# Altium project 7Bot.PrjPcb
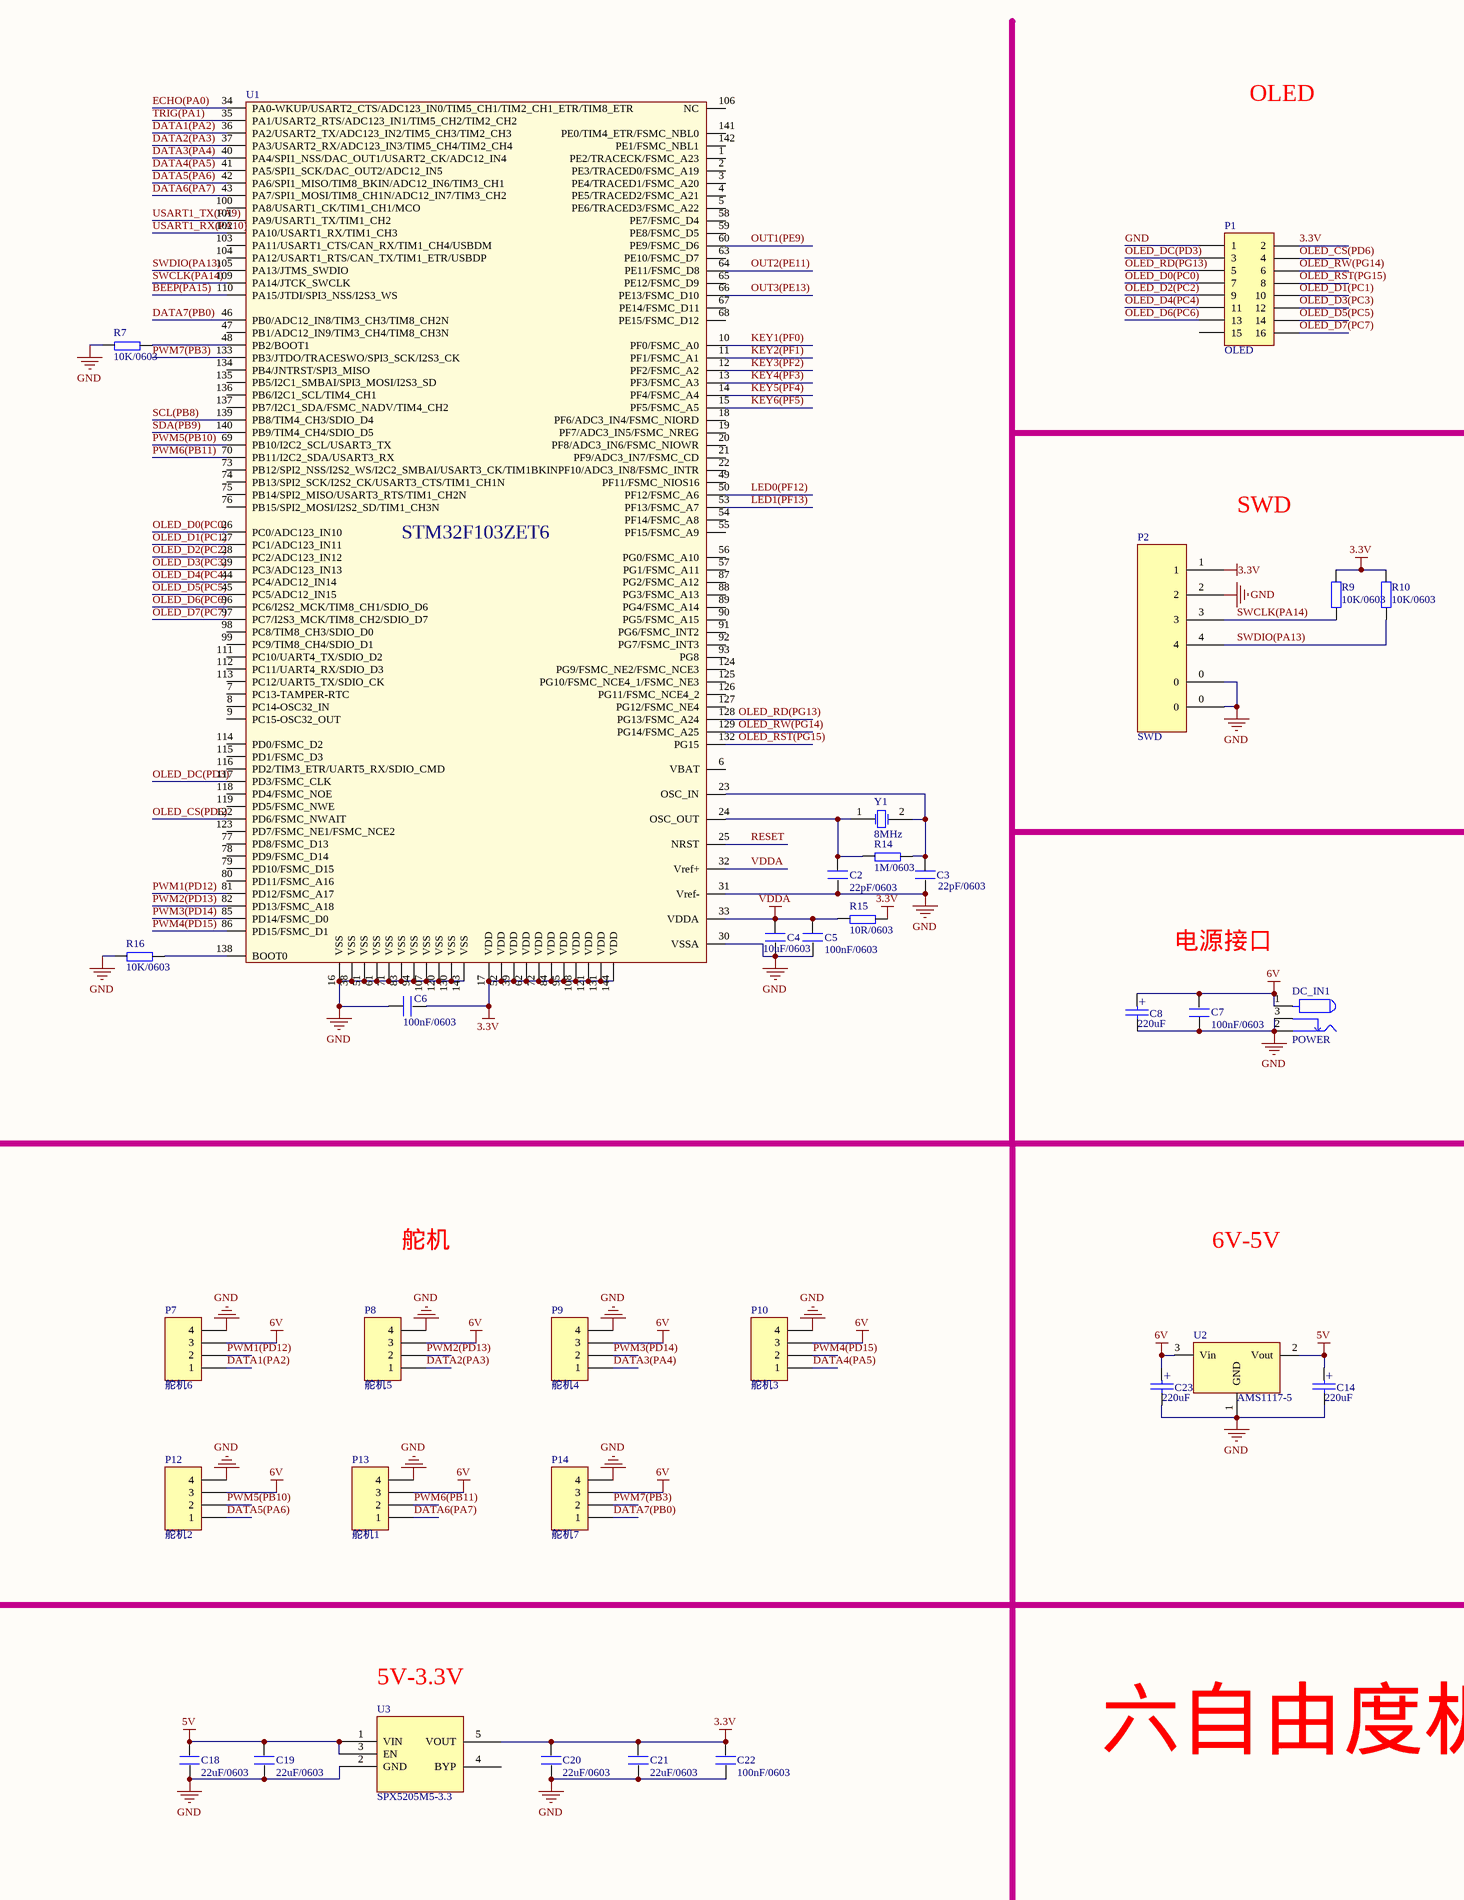
[diagram p0: 7BotSCH.SchDoc, left]
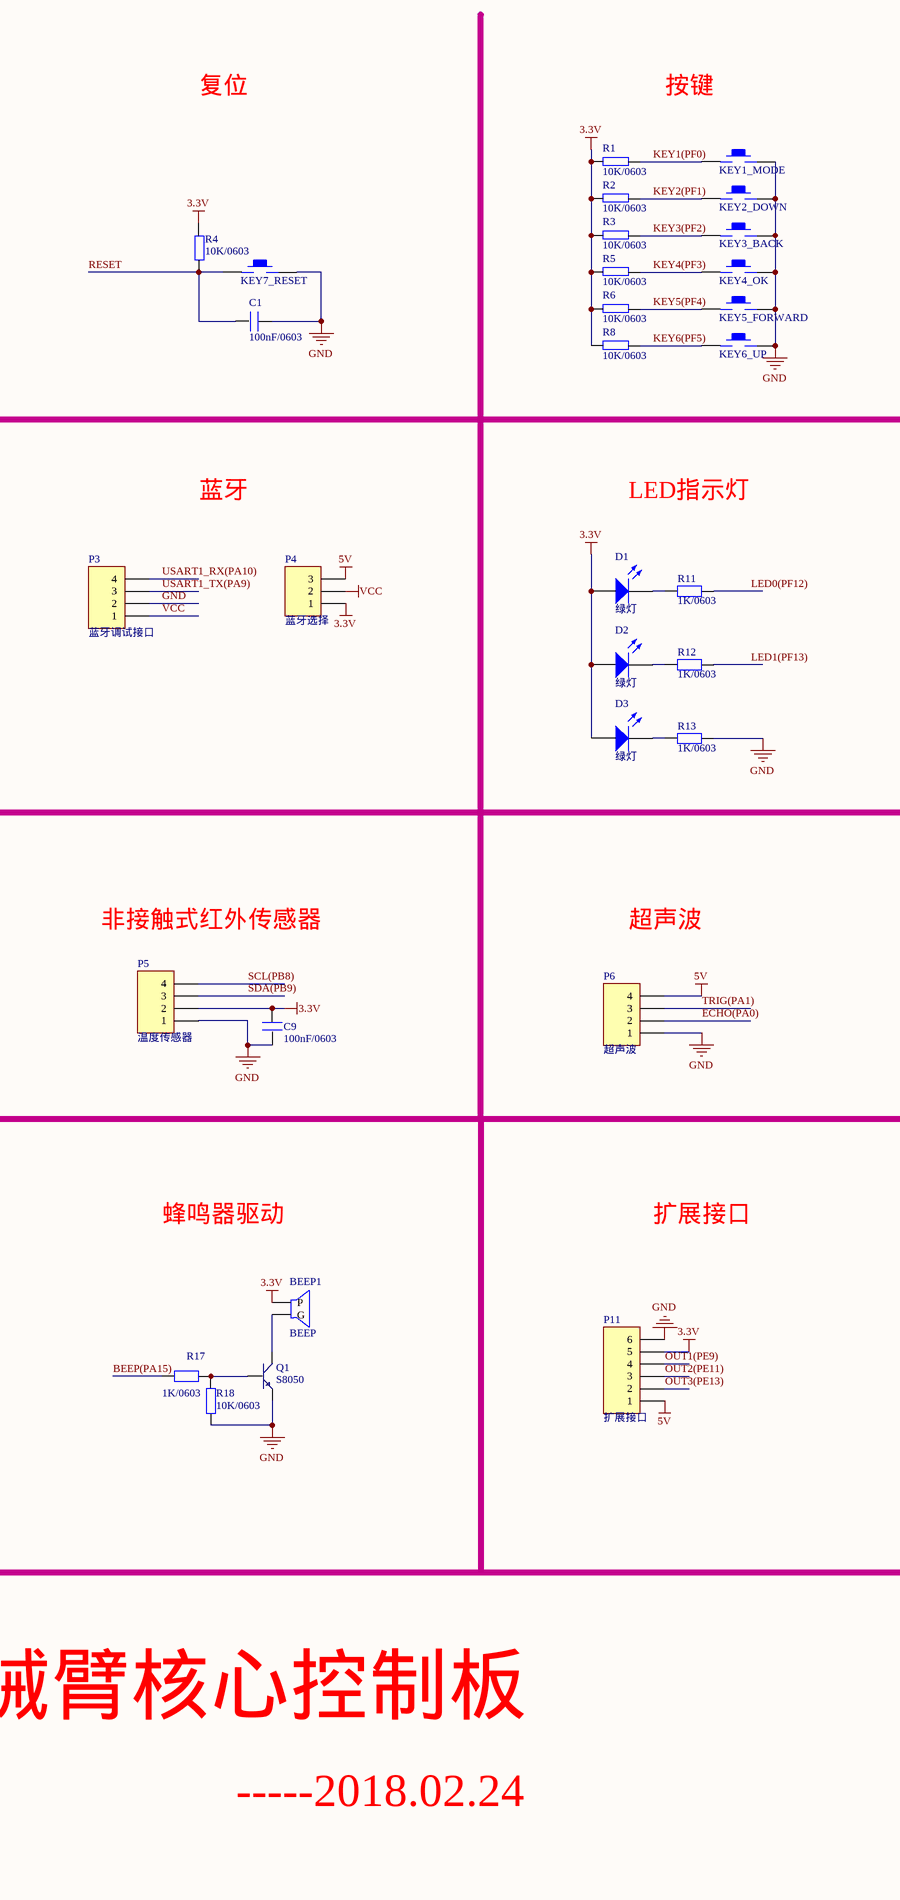
[diagram p1: 7BotSCH.SchDoc, right]
1 sheet, 65 parts. Net scope: global (net labels, ports and power ports of the same name join across sheets).
Board file: 7BotPCB.PcbDoc

## Sheet 7BotSCH.SchDoc
size A2

### Parts
BEEP1  BEEP  [BELL-5]
C1  100nF/0603  [0603-1]
C2  22pF/0603  [0603-1]
C3  22pF/0603  [0603-1]
C4  10uF/0603  [0603-1]
C5  100nF/0603  [0603-1]
C6  100nF/0603  [0603-1]
C7  100nF/0603  [0603-1]
C8  220uF  [1210]
C9  100nF/0603  [0603-1]
C14  220uF  [1210]
C18  22uF/0603  [0603-1]
C19  22uF/0603  [0603-1]
C20  22uF/0603  [0603-1]
C21  22uF/0603  [0603-1]
C22  100nF/0603  [0603-1]
C23  220uF  [1210]
D1  绿灯  [0603-1]
D2  绿灯  [0603-1]
D3  绿灯  [0603-1]
DC_IN1  POWER  [DC10B]
KEY1_MODE  KEY_M  [KEY_M]  (value not drawn)
KEY2_DOWN  KEY_M  [KEY_M]  (value not drawn)
KEY3_BACK  KEY_M  [KEY_M]  (value not drawn)
KEY4_OK  KEY_M  [KEY_M]  (value not drawn)
KEY5_FORWARD  KEY_M  [KEY_M]  (value not drawn)
KEY6_UP  KEY_M  [KEY_M]  (value not drawn)
KEY7_RESET  KEY_M  [KEY_M]  (value not drawn)
P1  OLED  [HDR2X8]
P2  SWD  [MOLEX4脚]
P3  蓝牙调试接口  [HDR1X4]
P4  蓝牙选择  [HDR1X3]
P5  温度传感器  [HDR1X4]
P6  超声波  [HDR1X4]
P7  舵机6  [HDR1X4]
P8  舵机5  [HDR1X4]
P9  舵机4  [HDR1X4]
P10  舵机3  [HDR1X4]
P11  扩展接口  [HDR1X6]
P12  舵机2  [HDR1X4]
P13  舵机1  [HDR1X4]
P14  舵机7  [HDR1X4]
Q1  S8050  [SOT-23R]
R1  10K/0603  [0603-1]
R2  10K/0603  [0603-1]
R3  10K/0603  [0603-1]
R4  10K/0603  [0603-1]
R5  10K/0603  [0603-1]
R6  10K/0603  [0603-1]
R7  10K/0603  [0603-1]
R8  10K/0603  [0603-1]
R9  10K/0603  [0603-1]
R10  10K/0603  [0603-1]
R11  1K/0603  [0603-1]
R12  1K/0603  [0603-1]
R13  1K/0603  [0603-1]
R14  1M/0603  [0603-1]
R15  10R/0603  [0603-1]
R16  10K/0603  [0603-1]
R17  value 1K/0603  [0603-1]  (hidden comment: Res1)
R18  value 10K/0603  [0603-1]  (hidden comment: Res1)
U1  STM32F103ZET6  [LQFP144]
U2  AMS1117-5  [SOT-223L]
U3  SPX5205M5-3.3  [SOT23-5]
Y1  8MHz  [25M两脚无源晶振5032]

### Nets
3.3V: BEEP1.1(P) C6.2 C9.2 C20.2 C21.2 C22.2 D1.1(A) D2.1(A) D3.1(A) P1.2 P2.1 P4.1 P5.2 P11.5 R1.2 R2.2 R3.2 R4.2 R5.2 R6.2 R8.2 R9.1 R10.1 R15.2 U1.17(VDD) U1.39(VDD) U1.52(VDD) U1.62(VDD) U1.72(VDD) U1.84(VDD) U1.95(VDD) U1.108(VDD) U1.121(VDD) U1.131(VDD) U1.144(VDD) U3.5(VOUT)
5V: C14.1 C18.2 C19.2 P4.3 P6.4 P11.1 U2.2(Vout) U3.1(VIN) U3.3(EN)
6V: C7.1 C8.1 C23.1 DC_IN1.1 P7.3 P8.3 P9.3 P10.3 P12.3 P13.3 P14.3 U2.3(Vin)
GND: C1.1 C2.1 C3.1 C4.1 C5.1 C6.1 C7.2 C8.2 C9.1 C14.2 C18.1 C19.1 C20.1 C21.1 C22.1 C23.2 DC_IN1.2 DC_IN1.3 KEY1_MODE.2 KEY2_DOWN.2 KEY3_BACK.2 KEY4_OK.2 KEY5_FORWARD.2 KEY6_UP.2 KEY7_RESET.2 P1.1 P2.0 P2.2 P3.2 P5.1 P6.1 P7.4 P8.4 P9.4 P10.4 P11.6 P12.4 P13.4 P14.4 Q1.1(E) R7.1 R13.1 R16.1 R18.1 U1.16(VSS) U1.30(VSSA) U1.31(Vref-) U1.38(VSS) U1.51(VSS) U1.61(VSS) U1.71(VSS) U1.83(VSS) U1.94(VSS) U1.107(VSS) U1.120(VSS) U1.130(VSS) U1.143(VSS) U2.1(GND) U3.2(GND)
VCC: P3.1 P4.2
VDDA: C4.2 C5.2 R15.1 U1.32(Vref+) U1.33(VDDA)
BEEP(PA15): R17.1 U1.110(PA15/JTDI/SPI3_NSS/I2S3_WS)
DATA1(PA2): P7.1 U1.36(PA2/USART2_TX/ADC123_IN2/TIM5_CH3/TIM2_CH3)
DATA2(PA3): P8.1 U1.37(PA3/USART2_RX/ADC123_IN3/TIM5_CH4/TIM2_CH4)
DATA3(PA4): P9.1 U1.40(PA4/SPI1_NSS/DAC_OUT1/USART2_CK/ADC12_IN4)
DATA4(PA5): P10.1 U1.41(PA5/SPI1_SCK/DAC_OUT2/ADC12_IN5)
DATA5(PA6): P12.1 U1.42(PA6/SPI1_MISO/TIM8_BKIN/ADC12_IN6/TIM3_CH1)
DATA6(PA7): P13.1 U1.43(PA7/SPI1_MOSI/TIM8_CH1N/ADC12_IN7/TIM3_CH2)
DATA7(PB0): P14.1 U1.46(PB0/ADC12_IN8/TIM3_CH3/TIM8_CH2N)
ECHO(PA0): P6.2 U1.34(PA0-WKUP/USART2_CTS/ADC123_IN0/TIM5_CH1/TIM2_CH1_ETR/TIM8_ETR)
KEY1(PF0): KEY1_MODE.1 R1.1 U1.10(PF0/FSMC_A0)
KEY2(PF1): KEY2_DOWN.1 R2.1 U1.11(PF1/FSMC_A1)
KEY3(PF2): KEY3_BACK.1 R3.1 U1.12(PF2/FSMC_A2)
KEY4(PF3): KEY4_OK.1 R5.1 U1.13(PF3/FSMC_A3)
KEY5(PF4): KEY5_FORWARD.1 R6.1 U1.14(PF4/FSMC_A4)
KEY6(PF5): KEY6_UP.1 R8.1 U1.15(PF5/FSMC_A5)
LED0(PF12): R11.1 U1.50(PF12/FSMC_A6)
LED1(PF13): R12.1 U1.53(PF13/FSMC_A7)
OLED_CS(PD6): P1.4 U1.122(PD6/FSMC_NWAIT)
OLED_D0(PC0): P1.7 U1.26(PC0/ADC123_IN10)
OLED_D1(PC1): P1.10 U1.27(PC1/ADC123_IN11)
OLED_D2(PC2): P1.9 U1.28(PC2/ADC123_IN12)
OLED_D3(PC3): P1.12 U1.29(PC3/ADC123_IN13)
OLED_D4(PC4): P1.11 U1.44(PC4/ADC12_IN14)
OLED_D5(PC5): P1.14 U1.45(PC5/ADC12_IN15)
OLED_D6(PC6): P1.13 U1.96(PC6/I2S2_MCK/TIM8_CH1/SDIO_D6)
OLED_D7(PC7): P1.16 U1.97(PC7/I2S3_MCK/TIM8_CH2/SDIO_D7)
OLED_DC(PD3): P1.3 U1.117(PD3/FSMC_CLK)
OLED_RD(PG13): P1.5 U1.128(PG13/FSMC_A24)
OLED_RST(PG15): P1.8 U1.132(PG15)
OLED_RW(PG14): P1.6 U1.129(PG14/FSMC_A25)
OUT1(PE9): P11.4 U1.60(PE9/FSMC_D6)
OUT2(PE11): P11.3 U1.64(PE11/FSMC_D8)
OUT3(PE13): P11.2 U1.66(PE13/FSMC_D10)
PWM1(PD12): P7.2 U1.81(PD12/FSMC_A17)
PWM2(PD13): P8.2 U1.82(PD13/FSMC_A18)
PWM3(PD14): P9.2 U1.85(PD14/FSMC_D0)
PWM4(PD15): P10.2 U1.86(PD15/FSMC_D1)
PWM5(PB10): P12.2 U1.69(PB10/I2C2_SCL/USART3_TX)
PWM6(PB11): P13.2 U1.70(PB11/I2C2_SDA/USART3_RX)
PWM7(PB3): P14.2 U1.133(PB3/JTDO/TRACESWO/SPI3_SCK/I2S3_CK)
RESET: C1.2 KEY7_RESET.1 R4.1 U1.25(NRST)
SCL(PB8): P5.4 U1.139(PB8/TIM4_CH3/SDIO_D4)
SDA(PB9): P5.3 U1.140(PB9/TIM4_CH4/SDIO_D5)
SWCLK(PA14): P2.3 R9.2 U1.109(PA14/JTCK_SWCLK)
SWDIO(PA13): P2.4 R10.2 U1.105(PA13/JTMS_SWDIO)
TRIG(PA1): P6.3 U1.35(PA1/USART2_RTS/ADC123_IN1/TIM5_CH2/TIM2_CH2)
USART1_RX(PA10): P3.4 U1.102(PA10/USART1_RX/TIM1_CH3)
USART1_TX(PA9): P3.3 U1.101(PA9/USART1_TX/TIM1_CH2)
NetBEEP1_2: BEEP1.2(G) Q1.3(C)
NetC2_2: C2.2 R14.1 U1.24(OSC_OUT) Y1.1(OSC1)
NetC3_2: C3.2 R14.2 U1.23(OSC_IN) Y1.2(OSC2)
NetD1_2: D1.2(K) R11.2
NetD2_2: D2.2(K) R12.2
NetD3_2: D3.2(K) R13.2
NetQ1_2: Q1.2(B) R17.2 R18.2
NetR7_2: R7.2 U1.48(PB2/BOOT1)
NetR16_2: R16.2 U1.138(BOOT0)

Not connected (* = marked no-connect by the designer): P1 15; U1 1(PE2/TRACECK/FSMC_A23) 2(PE3/TRACED0/FSMC_A19) 3(PE4/TRACED1/FSMC_A20) 4(PE5/TRACED2/FSMC_A21) 5(PE6/TRACED3/FSMC_A22) 6(VBAT) 7(PC13-TAMPER-RTC) 8(PC14-OSC32_IN) 9(PC15-OSC32_OUT) 18(PF6/ADC3_IN4/FSMC_NIORD) 19(PF7/ADC3_IN5/FSMC_NREG) 20(PF8/ADC3_IN6/FSMC_NIOWR) 21(PF9/ADC3_IN7/FSMC_CD) 22(PF10/ADC3_IN8/FSMC_INTR) 47(PB1/ADC12_IN9/TIM3_CH4/TIM8_CH3N) 49(PF11/FSMC_NIOS16) 54(PF14/FSMC_A8) 55(PF15/FSMC_A9) 56(PG0/FSMC_A10) 57(PG1/FSMC_A11) 58(PE7/FSMC_D4) 59(PE8/FSMC_D5) 63(PE10/FSMC_D7) 65(PE12/FSMC_D9) 67(PE14/FSMC_D11) 68(PE15/FSMC_D12) 73(PB12/SPI2_NSS/I2S2_WS/I2C2_SMBAI/USART3_CK/TIM1BKIN) 74(PB13/SPI2_SCK/I2S2_CK/USART3_CTS/TIM1_CH1N) 75(PB14/SPI2_MISO/USART3_RTS/TIM1_CH2N) 76(PB15/SPI2_MOSI/I2S2_SD/TIM1_CH3N) 77(PD8/FSMC_D13) 78(PD9/FSMC_D14) 79(PD10/FSMC_D15) 80(PD11/FSMC_A16) 87(PG2/FSMC_A12) 88(PG3/FSMC_A13) 89(PG4/FSMC_A14) 90(PG5/FSMC_A15) 91(PG6/FSMC_INT2) 92(PG7/FSMC_INT3) 93(PG8) 98(PC8/TIM8_CH3/SDIO_D0) 99(PC9/TIM8_CH4/SDIO_D1) 100(PA8/USART1_CK/TIM1_CH1/MCO) 103(PA11/USART1_CTS/CAN_RX/TIM1_CH4/USBDM) 104(PA12/USART1_RTS/CAN_TX/TIM1_ETR/USBDP) 106(NC) 111(PC10/UART4_TX/SDIO_D2) 112(PC11/UART4_RX/SDIO_D3) 113(PC12/UART5_TX/SDIO_CK) 114(PD0/FSMC_D2) 115(PD1/FSMC_D3) 116(PD2/TIM3_ETR/UART5_RX/SDIO_CMD) 118(PD4/FSMC_NOE) 119(PD5/FSMC_NWE) 123(PD7/FSMC_NE1/FSMC_NCE2) 124(PG9/FSMC_NE2/FSMC_NCE3) 125(PG10/FSMC_NCE4_1/FSMC_NE3) 126(PG11/FSMC_NCE4_2) 127(PG12/FSMC_NE4) 134(PB4/JNTRST/SPI3_MISO) 135(PB5/I2C1_SMBAI/SPI3_MOSI/I2S3_SD) 136(PB6/I2C1_SCL/TIM4_CH1) 137(PB7/I2C1_SDA/FSMC_NADV/TIM4_CH2) 141(PE0/TIM4_ETR/FSMC_NBL0) 142(PE1/FSMC_NBL1); U3 4(BYP)

### Notes on the sheet
- OLED
- 复位
- 按键
- SWD
- 蓝牙
- LED指示灯
- 电源接口
- 非接触式红外传感器
- 超声波
- 舵机
- 6V-5V
- 蜂鸣器驱动
- 扩展接口
- 5V-3.3V
- 六自由度机械臂核心控制板
- -----2018.02.24
- (in symbol Cap) +

### Library data of the parts
C1 C6 C7 C9 C18-C22 = C_3
C2 C3 C5 = C
C4 = C_2
C8 C14 C23 = Cap
D1-D3 = LED0: 发光二极管; Published: 8-Jun-2000; LatestRevisionDate: 08-Jul-2005; LatestRevisionNote: Mech Layer 1 removed.; PackageReference: LED-0; Publisher: Altium Limited
DC_IN1 = POW
P1 = Header 8X2: Header, 8-Pin, Dual row; LatestRevisionDate: 17-Jul-2002; LatestRevisionNote: Re-released for DXP Platform.; Publisher: Altium Limited
P2 = MOLEX4
P3 P5-P10 P12-P14 = Header 4: Header, 4-Pin; LatestRevisionDate: 17-Jul-2002; LatestRevisionNote: Re-released for DXP Platform.; Publisher: Altium Limited
P4 = Header 3: Header, 3-Pin; LatestRevisionDate: 17-Jul-2002; LatestRevisionNote: Re-released for DXP Platform.; Publisher: Altium Limited
P11 = Header 6: Header, 6-Pin; LatestRevisionDate: 17-Jul-2002; LatestRevisionNote: Re-released for DXP Platform.; Publisher: Altium Limited
Q1 = NPN: 8050/BCW846/BCW847
R1-R8 R14-R16 = R_1
R9-R13 R17 R18 = Res1: 贴片电阻; Published: 8-Jun-2000; LatestRevisionDate: 17-Jul-2002; LatestRevisionNote: Re-released for DXP Platform.; PackageReference: AXIAL-0.4; Publisher: Altium Limited
  R9 R10: Value: 10K/0603
  R11-R13: Value: 1K/0603
U2 = 1117
U3 = SPX5205M5-3.3V
Y1 = XTAL: Crystal Oscillator; Published: 8-Jun-2000; LatestRevisionDate: 17-Jul-2002; LatestRevisionNote: Re-released for DXP Platform.; Publisher: Altium Limited